# EAGLE design APA106_uno_shield (EAGLE 7.4.0)
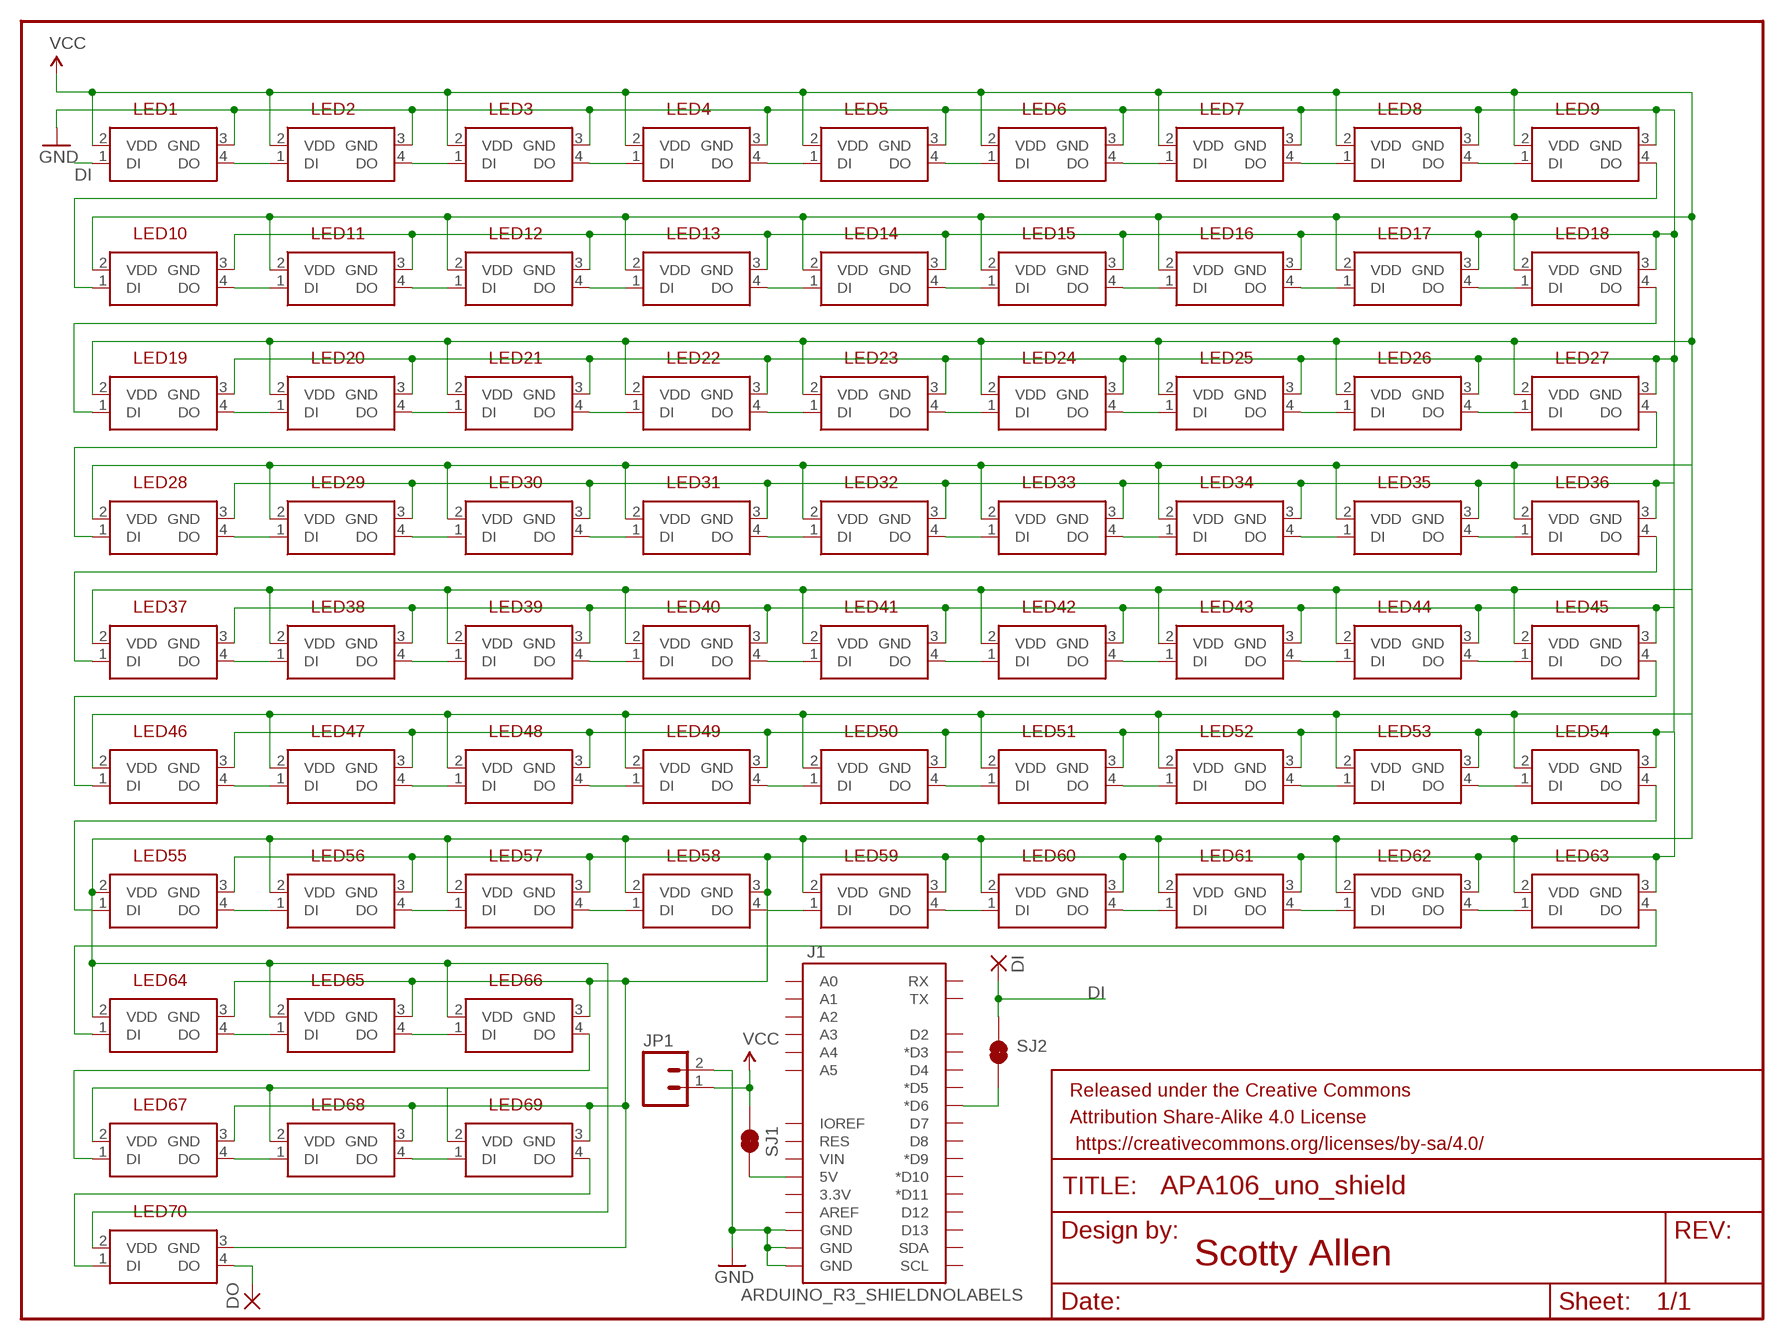
[diagram p0: schematic, sheet 1]

## Parts
DI  1,6/0,9  [1,6/0,9]
DO  1,6/0,9  [1,6/0,9]
FRAME1  FRAME-LETTER  [CREATIVE_COMMONS]
J1  ARDUINO_R3_SHIELDNOLABELS  [UNO_R3_SHIELD_NOLABELS]
JP1  M02PTH  [1X02]
LED1  LED-APA106HOLE-OFFSET-SPREAD  [LED-5MM-4PIN-HOLE-OFFSET-SPREAD]
LED2  LED-APA106HOLE-OFFSET-SPREAD  [LED-5MM-4PIN-HOLE-OFFSET-SPREAD]
LED3  LED-APA106HOLE-OFFSET-SPREAD  [LED-5MM-4PIN-HOLE-OFFSET-SPREAD]
LED4  LED-APA106HOLE-OFFSET-SPREAD  [LED-5MM-4PIN-HOLE-OFFSET-SPREAD]
LED5  LED-APA106HOLE-OFFSET-SPREAD  [LED-5MM-4PIN-HOLE-OFFSET-SPREAD]
LED6  LED-APA106HOLE-OFFSET-SPREAD  [LED-5MM-4PIN-HOLE-OFFSET-SPREAD]
LED7  LED-APA106HOLE-OFFSET-SPREAD  [LED-5MM-4PIN-HOLE-OFFSET-SPREAD]
LED8  LED-APA106HOLE-OFFSET-SPREAD  [LED-5MM-4PIN-HOLE-OFFSET-SPREAD]
LED9  LED-APA106HOLE-OFFSET-SPREAD  [LED-5MM-4PIN-HOLE-OFFSET-SPREAD]
LED10  LED-APA106HOLE-OFFSET-SPREAD  [LED-5MM-4PIN-HOLE-OFFSET-SPREAD]
LED11  LED-APA106HOLE-OFFSET-SPREAD  [LED-5MM-4PIN-HOLE-OFFSET-SPREAD]
LED12  LED-APA106HOLE-OFFSET-SPREAD  [LED-5MM-4PIN-HOLE-OFFSET-SPREAD]
LED13  LED-APA106HOLE-OFFSET-SPREAD  [LED-5MM-4PIN-HOLE-OFFSET-SPREAD]
LED14  LED-APA106HOLE-OFFSET-SPREAD  [LED-5MM-4PIN-HOLE-OFFSET-SPREAD]
LED15  LED-APA106HOLE-OFFSET-SPREAD  [LED-5MM-4PIN-HOLE-OFFSET-SPREAD]
LED16  LED-APA106HOLE-OFFSET-SPREAD  [LED-5MM-4PIN-HOLE-OFFSET-SPREAD]
LED17  LED-APA106HOLE-OFFSET-SPREAD  [LED-5MM-4PIN-HOLE-OFFSET-SPREAD]
LED18  LED-APA106HOLE-OFFSET-SPREAD  [LED-5MM-4PIN-HOLE-OFFSET-SPREAD]
LED19  LED-APA106HOLE-OFFSET-SPREAD  [LED-5MM-4PIN-HOLE-OFFSET-SPREAD]
LED20  LED-APA106HOLE-OFFSET-SPREAD  [LED-5MM-4PIN-HOLE-OFFSET-SPREAD]
LED21  LED-APA106HOLE-OFFSET-SPREAD  [LED-5MM-4PIN-HOLE-OFFSET-SPREAD]
LED22  LED-APA106HOLE-OFFSET-SPREAD  [LED-5MM-4PIN-HOLE-OFFSET-SPREAD]
LED23  LED-APA106HOLE-OFFSET-SPREAD  [LED-5MM-4PIN-HOLE-OFFSET-SPREAD]
LED24  LED-APA106HOLE-OFFSET-SPREAD  [LED-5MM-4PIN-HOLE-OFFSET-SPREAD]
LED25  LED-APA106HOLE-OFFSET-SPREAD  [LED-5MM-4PIN-HOLE-OFFSET-SPREAD]
LED26  LED-APA106HOLE-OFFSET-SPREAD  [LED-5MM-4PIN-HOLE-OFFSET-SPREAD]
LED27  LED-APA106HOLE-OFFSET-SPREAD  [LED-5MM-4PIN-HOLE-OFFSET-SPREAD]
LED28  LED-APA106HOLE-OFFSET-SPREAD  [LED-5MM-4PIN-HOLE-OFFSET-SPREAD]
LED29  LED-APA106HOLE-OFFSET-SPREAD  [LED-5MM-4PIN-HOLE-OFFSET-SPREAD]
LED30  LED-APA106HOLE-OFFSET-SPREAD  [LED-5MM-4PIN-HOLE-OFFSET-SPREAD]
LED31  LED-APA106HOLE-OFFSET-SPREAD  [LED-5MM-4PIN-HOLE-OFFSET-SPREAD]
LED32  LED-APA106HOLE-OFFSET-SPREAD  [LED-5MM-4PIN-HOLE-OFFSET-SPREAD]
LED33  LED-APA106HOLE-OFFSET-SPREAD  [LED-5MM-4PIN-HOLE-OFFSET-SPREAD]
LED34  LED-APA106HOLE-OFFSET-SPREAD  [LED-5MM-4PIN-HOLE-OFFSET-SPREAD]
LED35  LED-APA106HOLE-OFFSET-SPREAD  [LED-5MM-4PIN-HOLE-OFFSET-SPREAD]
LED36  LED-APA106HOLE-OFFSET-SPREAD  [LED-5MM-4PIN-HOLE-OFFSET-SPREAD]
LED37  LED-APA106HOLE-OFFSET-SPREAD  [LED-5MM-4PIN-HOLE-OFFSET-SPREAD]
LED38  LED-APA106HOLE-OFFSET-SPREAD  [LED-5MM-4PIN-HOLE-OFFSET-SPREAD]
LED39  LED-APA106HOLE-OFFSET-SPREAD  [LED-5MM-4PIN-HOLE-OFFSET-SPREAD]
LED40  LED-APA106HOLE-OFFSET-SPREAD  [LED-5MM-4PIN-HOLE-OFFSET-SPREAD]
LED41  LED-APA106HOLE-OFFSET-SPREAD  [LED-5MM-4PIN-HOLE-OFFSET-SPREAD]
LED42  LED-APA106HOLE-OFFSET-SPREAD  [LED-5MM-4PIN-HOLE-OFFSET-SPREAD]
LED43  LED-APA106HOLE-OFFSET-SPREAD  [LED-5MM-4PIN-HOLE-OFFSET-SPREAD]
LED44  LED-APA106HOLE-OFFSET-SPREAD  [LED-5MM-4PIN-HOLE-OFFSET-SPREAD]
LED45  LED-APA106HOLE-OFFSET-SPREAD  [LED-5MM-4PIN-HOLE-OFFSET-SPREAD]
LED46  LED-APA106HOLE-OFFSET-SPREAD  [LED-5MM-4PIN-HOLE-OFFSET-SPREAD]
LED47  LED-APA106HOLE-OFFSET-SPREAD  [LED-5MM-4PIN-HOLE-OFFSET-SPREAD]
LED48  LED-APA106HOLE-OFFSET-SPREAD  [LED-5MM-4PIN-HOLE-OFFSET-SPREAD]
LED49  LED-APA106HOLE-OFFSET-SPREAD  [LED-5MM-4PIN-HOLE-OFFSET-SPREAD]
LED50  LED-APA106HOLE-OFFSET-SPREAD  [LED-5MM-4PIN-HOLE-OFFSET-SPREAD]
LED51  LED-APA106HOLE-OFFSET-SPREAD  [LED-5MM-4PIN-HOLE-OFFSET-SPREAD]
LED52  LED-APA106HOLE-OFFSET-SPREAD  [LED-5MM-4PIN-HOLE-OFFSET-SPREAD]
LED53  LED-APA106HOLE-OFFSET-SPREAD  [LED-5MM-4PIN-HOLE-OFFSET-SPREAD]
LED54  LED-APA106HOLE-OFFSET-SPREAD  [LED-5MM-4PIN-HOLE-OFFSET-SPREAD]
LED55  LED-APA106HOLE-OFFSET-SPREAD  [LED-5MM-4PIN-HOLE-OFFSET-SPREAD]
LED56  LED-APA106HOLE-OFFSET-SPREAD  [LED-5MM-4PIN-HOLE-OFFSET-SPREAD]
LED57  LED-APA106HOLE-OFFSET-SPREAD  [LED-5MM-4PIN-HOLE-OFFSET-SPREAD]
LED58  LED-APA106HOLE-OFFSET-SPREAD  [LED-5MM-4PIN-HOLE-OFFSET-SPREAD]
LED59  LED-APA106HOLE-OFFSET-SPREAD  [LED-5MM-4PIN-HOLE-OFFSET-SPREAD]
LED60  LED-APA106HOLE-OFFSET-SPREAD  [LED-5MM-4PIN-HOLE-OFFSET-SPREAD]
LED61  LED-APA106HOLE-OFFSET-SPREAD  [LED-5MM-4PIN-HOLE-OFFSET-SPREAD]
LED62  LED-APA106HOLE-OFFSET-SPREAD  [LED-5MM-4PIN-HOLE-OFFSET-SPREAD]
LED63  LED-APA106HOLE-OFFSET-SPREAD  [LED-5MM-4PIN-HOLE-OFFSET-SPREAD]
LED64  LED-APA106HOLE-OFFSET-SPREAD  [LED-5MM-4PIN-HOLE-OFFSET-SPREAD]
LED65  LED-APA106HOLE-OFFSET-SPREAD  [LED-5MM-4PIN-HOLE-OFFSET-SPREAD]
LED66  LED-APA106HOLE-OFFSET-SPREAD  [LED-5MM-4PIN-HOLE-OFFSET-SPREAD]
LED67  LED-APA106HOLE-OFFSET-SPREAD  [LED-5MM-4PIN-HOLE-OFFSET-SPREAD]
LED68  LED-APA106HOLE-OFFSET-SPREAD  [LED-5MM-4PIN-HOLE-OFFSET-SPREAD]
LED69  LED-APA106HOLE-OFFSET-SPREAD  [LED-5MM-4PIN-HOLE-OFFSET-SPREAD]
LED70  LED-APA106HOLE-OFFSET-SPREAD  [LED-5MM-4PIN-HOLE-OFFSET-SPREAD]
SJ1  JUMPER-PAD-2-NC_BY_TRACENO_SILK  [PAD-JUMPER-2-NC_BY_TRACE_NO_SILK]
SJ2  JUMPER-PAD-2-NC_BY_TRACENO_SILK  [PAD-JUMPER-2-NC_BY_TRACE_NO_SILK]

## Nets
DI: DI.1(P) LED1.1(DI) SJ2.2
GND [power]: J1.GND@0(GND) J1.GND@1(GND) J1.GND@2(GND) JP1.2 LED1.3(GND) LED2.3(GND) LED3.3(GND) LED4.3(GND) LED5.3(GND) LED6.3(GND) LED7.3(GND) LED8.3(GND) LED9.3(GND) LED10.3(GND) LED11.3(GND) LED12.3(GND) LED13.3(GND) LED14.3(GND) LED15.3(GND) LED16.3(GND) LED17.3(GND) LED18.3(GND) LED19.3(GND) LED20.3(GND) LED21.3(GND) LED22.3(GND) LED23.3(GND) LED24.3(GND) LED25.3(GND) LED26.3(GND) LED27.3(GND) LED28.3(GND) LED29.3(GND) LED30.3(GND) LED31.3(GND) LED32.3(GND) LED33.3(GND) LED34.3(GND) LED35.3(GND) LED36.3(GND) LED37.3(GND) LED38.3(GND) LED39.3(GND) LED40.3(GND) LED41.3(GND) LED42.3(GND) LED43.3(GND) LED44.3(GND) LED45.3(GND) LED46.3(GND) LED47.3(GND) LED48.3(GND) LED49.3(GND) LED50.3(GND) LED51.3(GND) LED52.3(GND) LED53.3(GND) LED54.3(GND) LED55.3(GND) LED56.3(GND) LED57.3(GND) LED58.3(GND) LED59.3(GND) LED60.3(GND) LED61.3(GND) LED62.3(GND) LED63.3(GND) LED64.3(GND) LED65.3(GND) LED66.3(GND) LED67.3(GND) LED68.3(GND) LED69.3(GND) LED70.3(GND)
N$1: LED1.4(DO) LED2.1(DI)
N$2: LED2.4(DO) LED3.1(DI)
N$3: LED3.4(DO) LED4.1(DI)
N$4: LED4.4(DO) LED5.1(DI)
N$5: LED6.4(DO) LED7.1(DI)
N$6: LED7.4(DO) LED8.1(DI)
N$7: LED37.4(DO) LED38.1(DI)
N$8: LED5.4(DO) LED6.1(DI)
N$9: LED8.4(DO) LED9.1(DI)
N$10: LED10.4(DO) LED11.1(DI)
N$11: LED19.4(DO) LED20.1(DI)
N$12: LED20.4(DO) LED21.1(DI)
N$13: LED11.4(DO) LED12.1(DI)
N$14: LED12.4(DO) LED13.1(DI)
N$15: LED21.4(DO) LED22.1(DI)
N$16: LED22.4(DO) LED23.1(DI)
N$17: LED18.4(DO) LED19.1(DI)
N$18: LED23.4(DO) LED24.1(DI)
N$19: LED13.4(DO) LED14.1(DI)
N$20: LED9.4(DO) LED10.1(DI)
N$21: LED14.4(DO) LED15.1(DI)
N$22: LED15.4(DO) LED16.1(DI)
N$23: LED16.4(DO) LED17.1(DI)
N$24: LED17.4(DO) LED18.1(DI)
N$25: LED24.4(DO) LED25.1(DI)
N$26: LED25.4(DO) LED26.1(DI)
N$27: LED26.4(DO) LED27.1(DI)
N$28: LED28.4(DO) LED29.1(DI)
N$29: LED29.4(DO) LED30.1(DI)
N$30: LED30.4(DO) LED31.1(DI)
N$31: LED31.4(DO) LED32.1(DI)
N$32: LED27.4(DO) LED28.1(DI)
N$33: LED32.4(DO) LED33.1(DI)
N$34: LED33.4(DO) LED34.1(DI)
N$35: LED34.4(DO) LED35.1(DI)
N$36: LED35.4(DO) LED36.1(DI)
N$37: LED38.4(DO) LED39.1(DI)
N$38: LED39.4(DO) LED40.1(DI)
N$39: LED40.4(DO) LED41.1(DI)
N$40: LED36.4(DO) LED37.1(DI)
N$41: LED41.4(DO) LED42.1(DI)
N$42: LED42.4(DO) LED43.1(DI)
N$43: LED43.4(DO) LED44.1(DI)
N$44: LED44.4(DO) LED45.1(DI)
N$45: LED46.4(DO) LED47.1(DI)
N$46: LED47.4(DO) LED48.1(DI)
N$47: LED48.4(DO) LED49.1(DI)
N$48: LED49.4(DO) LED50.1(DI)
N$49: LED45.4(DO) LED46.1(DI)
N$50: LED50.4(DO) LED51.1(DI)
N$51: LED51.4(DO) LED52.1(DI)
N$52: LED52.4(DO) LED53.1(DI)
N$53: LED53.4(DO) LED54.1(DI)
N$54: LED55.4(DO) LED56.1(DI)
N$55: LED56.4(DO) LED57.1(DI)
N$56: LED57.4(DO) LED58.1(DI)
N$57: LED58.4(DO) LED59.1(DI)
N$58: LED54.4(DO) LED55.1(DI)
N$59: LED59.4(DO) LED60.1(DI)
N$60: LED60.4(DO) LED61.1(DI)
N$61: LED61.4(DO) LED62.1(DI)
N$62: LED62.4(DO) LED63.1(DI)
N$63: LED64.4(DO) LED65.1(DI)
N$64: LED65.4(DO) LED66.1(DI)
N$65: LED67.4(DO) LED68.1(DI)
N$66: LED63.4(DO) LED64.1(DI)
N$67: LED68.4(DO) LED69.1(DI)
N$68: LED66.4(DO) LED67.1(DI)
N$69: LED69.4(DO) LED70.1(DI)
N$70 [lowpower]: J1.5V SJ1.1
N$71: DO.1(P) LED70.4(DO)
N$72: J1.D6(*D6) SJ2.1
VCC [power]: JP1.1 LED1.2(VDD) LED2.2(VDD) LED3.2(VDD) LED4.2(VDD) LED5.2(VDD) LED6.2(VDD) LED7.2(VDD) LED8.2(VDD) LED9.2(VDD) LED10.2(VDD) LED11.2(VDD) LED12.2(VDD) LED13.2(VDD) LED14.2(VDD) LED15.2(VDD) LED16.2(VDD) LED17.2(VDD) LED18.2(VDD) LED19.2(VDD) LED20.2(VDD) LED21.2(VDD) LED22.2(VDD) LED23.2(VDD) LED24.2(VDD) LED25.2(VDD) LED26.2(VDD) LED27.2(VDD) LED28.2(VDD) LED29.2(VDD) LED30.2(VDD) LED31.2(VDD) LED32.2(VDD) LED33.2(VDD) LED34.2(VDD) LED35.2(VDD) LED36.2(VDD) LED37.2(VDD) LED38.2(VDD) LED39.2(VDD) LED40.2(VDD) LED41.2(VDD) LED42.2(VDD) LED43.2(VDD) LED44.2(VDD) LED45.2(VDD) LED46.2(VDD) LED47.2(VDD) LED48.2(VDD) LED49.2(VDD) LED50.2(VDD) LED51.2(VDD) LED52.2(VDD) LED53.2(VDD) LED54.2(VDD) LED55.2(VDD) LED56.2(VDD) LED57.2(VDD) LED58.2(VDD) LED59.2(VDD) LED60.2(VDD) LED61.2(VDD) LED62.2(VDD) LED63.2(VDD) LED64.2(VDD) LED65.2(VDD) LED66.2(VDD) LED67.2(VDD) LED68.2(VDD) LED69.2(VDD) LED70.2(VDD) SJ1.2
Unconnected: J1.3.3V J1.A0 J1.A1 J1.A2 J1.A3 J1.A4 J1.A5 J1.AREF J1.D2 J1.D3(*D3) J1.D4 J1.D5(*D5) J1.D7 J1.D8 J1.D9(*D9) J1.D10(*D10) J1.D11(*D11) J1.D12 J1.D13 J1.IOREF J1.RES J1.RX J1.SCL J1.SDA J1.TX J1.VIN

## Library data of the parts
DI DO = wirepad:1,6/0,9: THROUGH-HOLE PAD
FRAME1 = SparkFun-Aesthetics:FRAME-LETTER: Schematic Frame Standard 8.5x11 US Letter frame
J1 = scotty:ARDUINO_R3_SHIELD: Shield form compatible with the Arduino Uno R3.
JP1 = SparkFun-Connectors:M02: Standard 2-pin 0.1" header. Use with - straight break away headers ( PRT-00116) - right angle break away headers (PRT-00553) - swiss pins (PRT-00743) - machine pins (PRT-00117) - female headers (PRT-00115) Molex polarized connector foot print use with: PRT-08233 with associated crimp pins and housings. 2.54_SCREWTERM for use with PRT-10571. 3.5mm Screw Terminal footprints for PRT-08084 5mm Screw Terminal footprints for use with PRT-08432
LED1-LED70 = scotty:LED-APA106
SJ1 SJ2 = scotty:JUMPER-PAD-2-NC_BY_TRACE

## Net classes
0 default: width 0.254 mm
1 power: width 1.27 mm
2 lowpower: width 0.406 mm

## Board
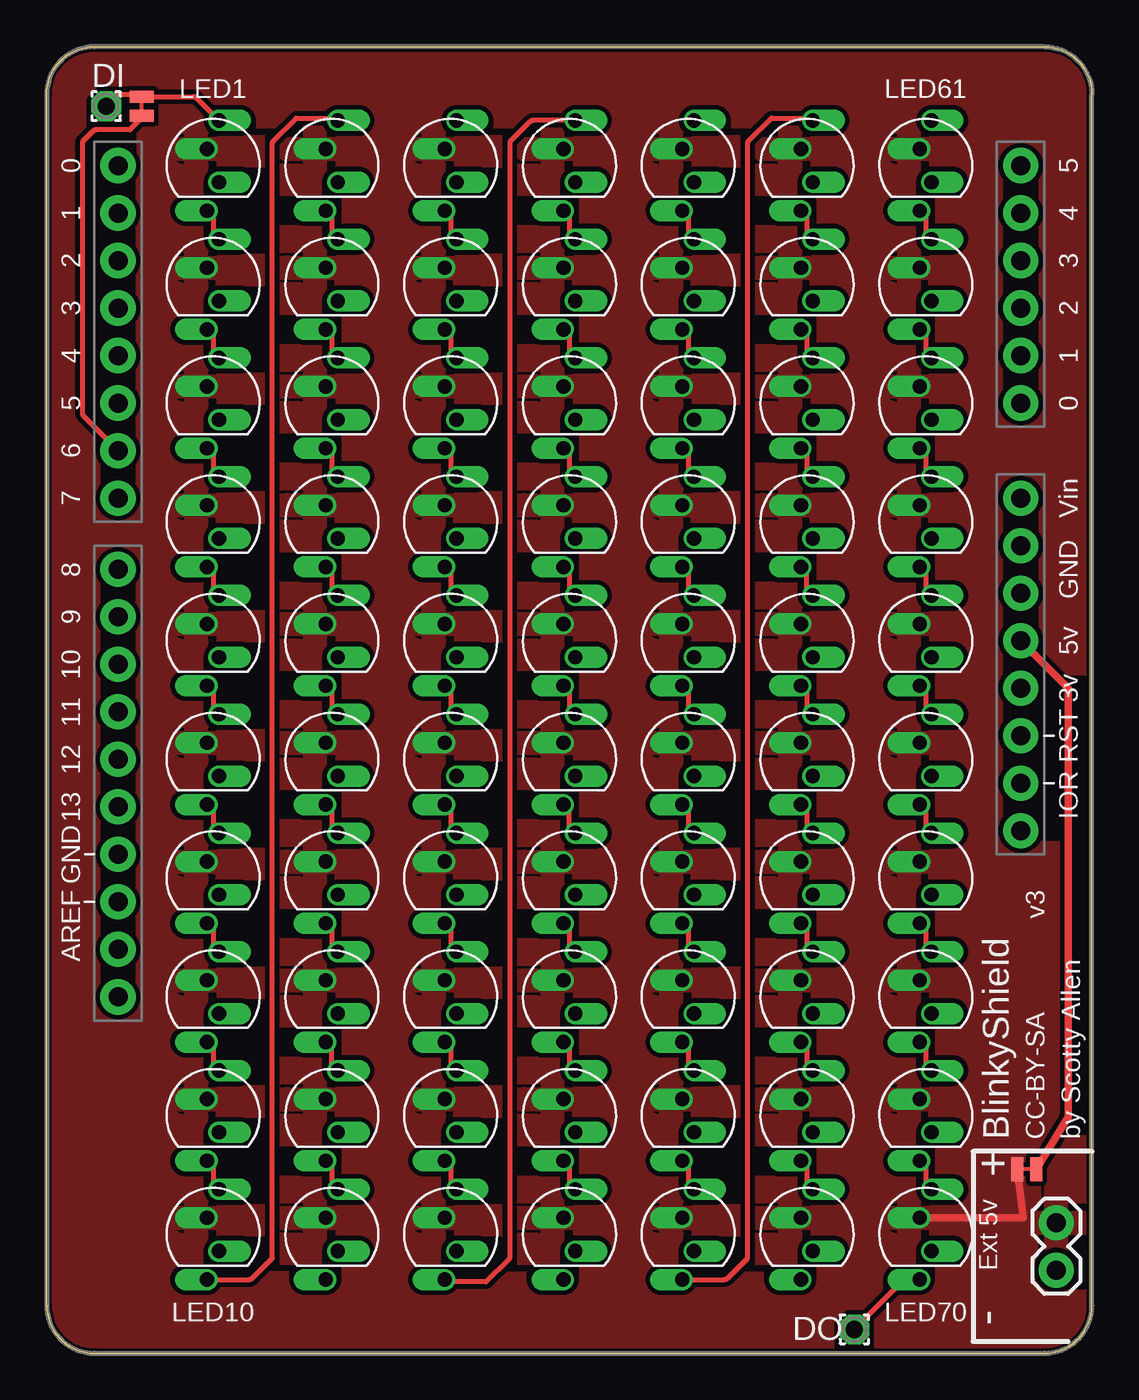
[diagram p1: board, top side]
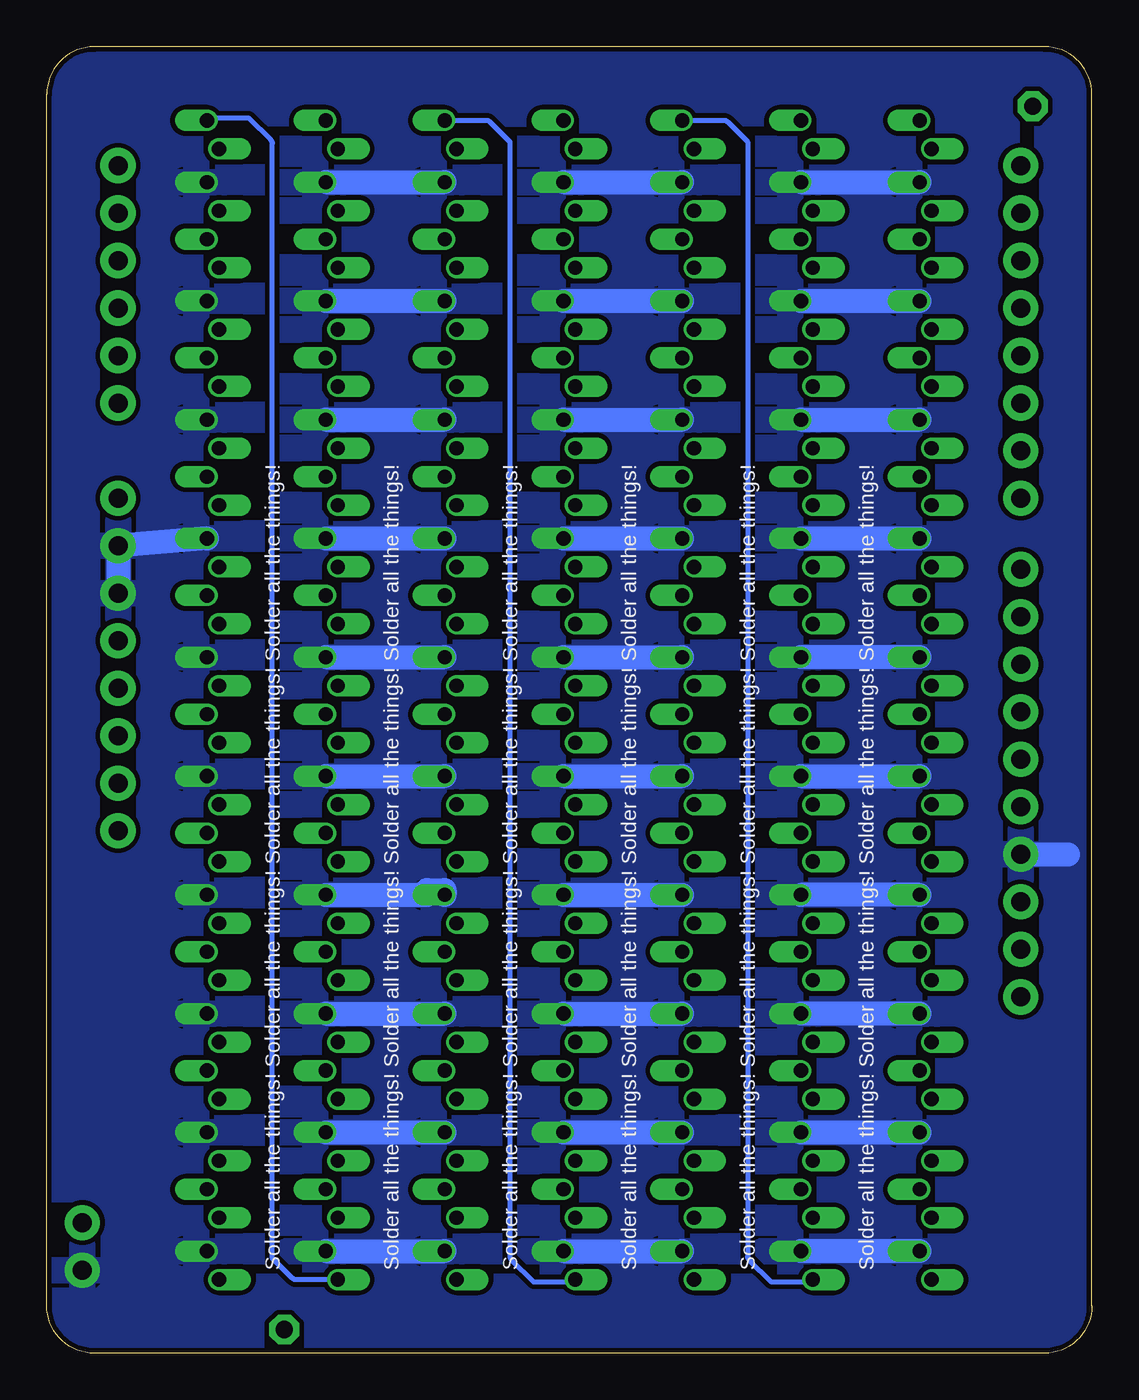
[diagram p2: board, bottom side, seen from below]

Size 55.88 x 69.85 mm. Coordinates in mm from the lower left corner, seen from the top.
Outline: 53.34,0 arc90 55.88,2.54 55.88,67.31 arc90 53.34,69.85 2.54,69.85 arc90 0,67.31 0,2.54 arc90 2.54,0 53.34,0
Copper layers (1*16): Top 0.035mm / dielectric 1.5mm / Bottom 0.035mm
Design rules "dirt_cheap_dirty_boards.v1 *": minimum track width 6mil, minimum drill 12mil, track to track 10mil, track to pad 10mil, pad to pad 10mil, via to via 10mil, smd to smd 0mil, copper to edge 10mil, drill to drill 10mil, minimum pad ring 6mil, minimum via ring 6mil, stop-mask expansion 2mil, vias tented up to drill 25mil, thermal gap 10mil

### Footprints (pad centres in the part's own frame; a part is rotated, then mirrored left to right if it is on the bottom)
1,6/0,9 = drill 0.914 pad 1.6 octagon: 1 0,0
UNO_R3_SHIELD_NOLABELS = drill 1.016 pad 1.88: 3.3V 52.07,35.56; 5V 52.07,38.1; A0 52.07,50.8; A1 52.07,53.34; A2 52.07,55.88; A3 52.07,58.42; A4 52.07,60.96; A5 52.07,63.5; AREF 3.81,24.13; D2 3.81,58.42; D3 3.81,55.88; D4 3.81,53.34; D5 3.81,50.8; D6 3.81,48.26; D7 3.81,45.72; D8 3.81,41.91; D9 3.81,39.37; D10 3.81,36.83; D11 3.81,34.29; D12 3.81,31.75; D13 3.81,29.21; GND@0 52.07,40.64; GND@1 52.07,43.18; GND@2 3.81,26.67; IOREF 52.07,30.48; NC 52.07,27.94; RES 52.07,33.02; RX 3.81,63.5; SCL 3.81,19.05; SDA 3.81,21.59; TX 3.81,60.96; VIN 52.07,45.72
1X02 = drill 1.016 pad 1.88: 1 0,0; 2 2.54,0
LED-5MM-4PIN-HOLE-OFFSET-SPREAD = drill 0.762 pad 1.016 offset: 1 -2.413,0.318; 2 -0.889,-0.318; 3 0.889,0.318; 4 2.413,-0.318
PAD-JUMPER-2-NC_BY_TRACE_NO_SILK = smd 0.635 x 1.27: 1 -0.508,0; 2 0.508,0

### Placement (x,y rotation side)
DI  3.17,66.67 0 top
DO  43.18,1.27 0 top
FRAME1  -5.71,-25.4 0 top  (outside the outline)
J1  0,0 0 top
JP1  53.98,6.99 270 top
LED1  8.89,63.5 270 top
LED2  8.89,57.15 270 top
LED3  8.89,50.8 270 top
LED4  8.89,44.45 270 top
LED5  8.89,38.1 270 top
LED6  8.89,31.75 270 top
LED7  8.89,25.4 270 top
LED8  8.89,19.05 270 top
LED9  8.89,12.7 270 top
LED10  8.89,6.35 270 top
LED11  15.24,63.5 270 top
LED12  15.24,57.15 270 top
LED13  15.24,50.8 270 top
LED14  15.24,44.45 270 top
LED15  15.24,38.1 270 top
LED16  15.24,31.75 270 top
LED17  15.24,25.4 270 top
LED18  15.24,19.05 270 top
LED19  15.24,12.7 270 top
LED20  15.24,6.35 270 top
LED21  21.59,63.5 270 top
LED22  21.59,57.15 270 top
LED23  21.59,50.8 270 top
LED24  21.59,44.45 270 top
LED25  21.59,38.1 270 top
LED26  21.59,31.75 270 top
LED27  21.59,25.4 270 top
LED28  21.59,19.05 270 top
LED29  21.59,12.7 270 top
LED30  21.59,6.35 270 top
LED31  27.94,63.5 270 top
LED32  27.94,57.15 270 top
LED33  27.94,50.8 270 top
LED34  27.94,44.45 270 top
LED35  27.94,38.1 270 top
LED36  27.94,31.75 270 top
LED37  27.94,25.4 270 top
LED38  27.94,19.05 270 top
LED39  27.94,12.7 270 top
LED40  27.94,6.35 270 top
LED41  34.29,63.5 270 top
LED42  34.29,57.15 270 top
LED43  34.29,50.8 270 top
LED44  34.29,44.45 270 top
LED45  34.29,38.1 270 top
LED46  34.29,31.75 270 top
LED47  34.29,25.4 270 top
LED48  34.29,19.05 270 top
LED49  34.29,12.7 270 top
LED50  34.29,6.35 270 top
LED51  40.64,63.5 270 top
LED52  40.64,57.15 270 top
LED53  40.64,50.8 270 top
LED54  40.64,44.45 270 top
LED55  40.64,38.1 270 top
LED56  40.64,31.75 270 top
LED57  40.64,25.4 270 top
LED58  40.64,19.05 270 top
LED59  40.64,12.7 270 top
LED60  40.64,6.35 270 top
LED61  46.99,63.5 270 top
LED62  46.99,57.15 270 top
LED63  46.99,50.8 270 top
LED64  46.99,44.45 270 top
LED65  46.99,38.1 270 top
LED66  46.99,31.75 270 top
LED67  46.99,25.4 270 top
LED68  46.99,19.05 270 top
LED69  46.99,12.7 270 top
LED70  46.99,6.35 270 top
SJ1  52.39,9.84 180 top
SJ2  5.08,66.67 90 top

### Tracks (layer width: path | path; a pad name or v marks a point on that pad's centre or on a via)
DI
  Top 0.254: DI.1 3.81,67.31 4.85,67.31 arc-45 5.03,67.24 SJ2.2 7.83,67.18 arc-45 8.01,67.11 LED1.1
GND
  Bottom 1.27: J1.GND@2 1.27,26.67 | J1.GND@0 J1.GND@1 LED64.3 | LED60.3 LED50.3 | LED40.3 LED30.3 | LED39.3 LED29.3 | LED59.3 LED49.3 | LED58.3 LED48.3 | LED57.3 35.56,24.51 35.56,24.77 34.61,24.77 LED47.3 | LED56.3 LED46.3 | LED55.3 LED45.3 | LED54.3 LED44.3 | LED53.3 LED43.3 | LED52.3 LED42.3 | LED51.3 LED41.3 | LED11.3 LED1.3 | LED12.3 LED2.3 | LED13.3 LED3.3 | LED14.3 LED4.3 | LED5.3 LED15.3 | LED16.3 LED6.3 | LED7.3 LED17.3 | LED8.3 LED18.3 | LED38.3 LED28.3 | LED37.3 LED27.3 | LED36.3 LED26.3 | LED19.3 LED9.3 | LED10.3 LED20.3 | LED35.3 LED25.3 | LED34.3 LED24.3 | LED33.3 LED23.3 | LED32.3 LED22.3 | LED31.3 LED21.3
  pour Bottom: 2.54,0 53.34,0 arc90 55.88,2.54 55.88,67.31 arc90 53.34,69.85 2.54,69.85 arc90 0,67.31 0,2.54 arc90
N$1
  Top 0.254: LED2.1 8.89,59.69 8.89,60.96 LED1.4
N$2
  Top 0.254: LED3.1 8.89,53.34 8.89,54.61 LED2.4
N$3
  Top 0.254: LED4.1 8.89,46.99 8.89,48.26 LED3.4
N$4
  Top 0.254: LED5.1 8.89,40.64 8.89,41.91 LED4.4
N$5
  Top 0.254: LED7.1 8.89,27.94 8.89,29.21 LED6.4
N$6
  Top 0.254: LED8.1 8.89,21.59 8.89,22.86 LED7.4
N$7
  Top 0.254: LED38.1 27.94,21.59 27.94,22.86 LED37.4
N$8
  Top 0.254: LED6.1 8.89,34.29 8.89,35.56 LED5.4
N$9
  Top 0.254: LED9.1 8.89,15.24 8.89,16.51 LED8.4
N$10
  Top 0.254: LED10.4 10.82,3.94 arc45 11,4.01 12.06,5.08 12.06,64.67 arc-45 12.14,64.84 13.34,66.04 15.32,66.04 arc-45 15.51,65.97 LED11.1
N$11
  Top 0.254: LED20.1 15.24,8.89 15.24,10.16 LED19.4
N$12
  Bottom 0.254: LED21.1 19.66,65.91 arc45 19.48,65.84 18.41,64.77 18.41,5.18 arc-45 18.34,5.01 17.14,3.81 15.15,3.81 arc-45 14.97,3.88 LED20.4
N$13
  Top 0.254: LED12.1 15.24,59.69 15.24,60.96 LED11.4
N$14
  Top 0.254: LED13.1 15.24,53.34 15.24,54.61 LED12.4
N$15
  Top 0.254: LED22.1 21.59,59.69 21.59,60.96 LED21.4
N$16
  Top 0.254: LED23.1 21.59,53.34 21.59,54.61 LED22.4
N$17
  Top 0.254: LED18.4 15.24,16.51 15.24,15.24 LED19.1
N$18
  Top 0.254: LED24.1 21.59,46.99 21.59,48.26 LED23.4
N$19
  Top 0.254: LED14.1 15.24,46.99 15.24,48.26 LED13.4
N$20
  Top 0.254: LED10.1 8.89,8.89 8.89,10.16 LED9.4
N$21
  Top 0.254: LED15.1 15.24,40.64 15.24,41.91 LED14.4
N$22
  Top 0.254: LED16.1 15.24,34.29 15.24,35.56 LED15.4
N$23
  Top 0.254: LED17.1 15.24,27.94 15.24,29.21 LED16.4
N$24
  Top 0.254: LED18.1 15.24,21.59 15.24,22.86 LED17.4
N$25
  Top 0.254: LED25.1 21.59,40.64 21.59,41.91 LED24.4
N$26
  Top 0.254: LED26.1 21.59,34.29 21.59,35.56 LED25.4
N$27
  Top 0.254: LED27.1 21.59,27.94 21.59,29.21 LED26.4
N$28
  Top 0.254: LED29.1 21.59,15.24 21.59,16.51 LED28.4
N$29
  Top 0.254: LED30.1 21.59,8.89 21.59,10.16 LED29.4
N$30
  Top 0.254: LED31.1 26.01,65.91 arc45 25.83,65.84 24.77,64.77 24.77,5.18 arc-45 24.69,5.01 23.5,3.81 21.5,3.81 arc-45 21.32,3.88 LED30.4
N$31
  Top 0.254: LED32.1 27.94,59.69 27.94,60.96 LED31.4
N$32
  Top 0.254: LED28.1 21.59,21.59 21.59,22.86 LED27.4
N$33
  Top 0.254: LED33.1 27.94,53.34 27.94,54.61 LED32.4
N$34
  Top 0.254: LED34.1 27.94,46.99 27.94,48.26 LED33.4
N$35
  Top 0.254: LED35.1 27.94,40.64 27.94,41.91 LED34.4
N$36
  Top 0.254: LED36.1 27.94,34.29 27.94,35.56 LED35.4
N$37
  Top 0.254: LED39.1 27.94,15.24 27.94,16.51 LED38.4
N$38
  Top 0.254: LED40.1 27.94,8.89 27.94,10.16 LED39.4
N$39
  Bottom 0.254: LED41.1 32.36,65.91 arc45 32.18,65.84 31.11,64.77 31.11,5.18 arc-45 31.04,5.01 29.84,3.81 27.86,3.81 arc-45 27.68,3.88 LED40.4
N$40
  Top 0.254: LED36.4 27.94,29.21 27.94,27.94 LED37.1
N$41
  Top 0.254: LED42.1 34.29,59.69 34.29,60.96 LED41.4
N$42
  Top 0.254: LED43.1 34.29,53.34 34.29,54.61 LED42.4
N$43
  Top 0.254: LED44.1 34.29,46.99 34.29,48.26 LED43.4
N$44
  Top 0.254: LED45.1 34.29,40.64 34.29,41.91 LED44.4
N$45
  Top 0.254: LED47.1 34.29,27.94 34.29,29.21 LED46.4
N$46
  Top 0.254: LED48.1 34.29,21.59 34.29,22.86 LED47.4
N$47
  Top 0.254: LED49.1 34.29,15.24 34.29,16.51 LED48.4
N$48
  Top 0.254: LED50.1 34.29,8.89 34.29,10.16 LED49.4
N$49
  Top 0.254: LED46.1 34.29,34.29 34.29,35.56 LED45.4
N$50
  Top 0.254: LED50.4 36.22,3.94 arc45 36.4,4.01 37.47,5.08 37.47,64.67 arc-45 37.54,64.84 38.73,66.04 40.73,66.04 arc-45 40.91,65.97 LED51.1
N$51
  Top 0.254: LED52.1 40.64,59.69 40.64,60.96 LED51.4
N$52
  Top 0.254: LED53.1 40.64,53.34 40.64,54.61 LED52.4
N$53
  Top 0.254: LED54.1 40.64,46.99 40.64,48.26 LED53.4
N$54
  Top 0.254: LED56.1 40.64,34.29 40.64,35.56 LED55.4
N$55
  Top 0.254: LED57.1 40.64,27.94 40.64,29.21 LED56.4
N$56
  Top 0.254: LED58.1 40.64,21.59 40.64,22.86 LED57.4
N$57
  Top 0.254: LED59.1 40.64,15.24 40.64,16.51 LED58.4
N$58
  Top 0.254: LED54.4 40.64,41.91 40.64,40.64 LED55.1
N$59
  Top 0.254: LED60.1 40.64,8.89 40.64,10.16 LED59.4
N$60
  Bottom 0.254: LED60.4 42.57,3.94 arc45 42.75,4.01 43.81,5.08 43.81,64.67 arc-45 43.89,64.84 45.09,66.04 47.08,66.04 arc-45 47.26,65.97 LED61.1
N$61
  Top 0.254: LED62.1 46.99,59.69 46.99,60.96 LED61.4
N$62
  Top 0.254: LED63.1 46.99,53.34 46.99,54.61 LED62.4
N$63
  Top 0.254: LED65.1 46.99,40.64 46.99,41.91 LED64.4
N$64
  Top 0.254: LED66.1 46.99,34.29 46.99,35.56 LED65.4
N$65
  Top 0.254: LED68.1 46.99,21.59 46.99,22.86 LED67.4
N$66
  Top 0.254: LED64.1 46.99,46.99 46.99,48.26 LED63.4
N$67
  Top 0.254: LED69.1 46.99,15.24 46.99,16.51 LED68.4
N$68
  Top 0.254: LED67.1 46.99,27.94 46.99,29.21 LED66.4
N$69
  Top 0.254: LED70.1 46.99,8.89 46.99,10.16 LED69.4
N$70
  Top 0.406: J1.5V 54.61,35.56 54.61,12.68 arc-45 54.54,12.5 SJ1.1
N$71
  Top 0.254: LED70.4 45.95,3.94 arc45 45.77,3.86 DO.1
N$72
  Top 0.254: SJ2.1 5.08,66.14 arc-45 5.01,65.97 4.45,65.41 2.65,65.41 arc45 2.47,65.33 1.91,64.77 1.91,50.27 arc45 1.98,50.09 J1.D6
VCC
  Top 0.406: LED70.2 52.2,7.24 SJ1.2
  pour Top: 0,2.54 arc90 2.54,0 53.34,0 arc90 55.88,2.54 55.88,67.31 arc90 53.34,69.85 2.54,69.85 arc90 0,67.31

### Text on the board
tPlace: v3 | BlinkyShield | CC-BY-SA | by Scotty Allen | Ext 5v
tNames: + | -
bNames: Solder all the things! Solder all the things! Solder all the things! Solder all the things! | Solder all the things! Solder all the things! Solder all the things! Solder all the things! | Solder all the things! Solder all the things! Solder all the things! Solder all the things! | Solder all the things! Solder all the things! Solder all the things! Solder all the things! | Solder all the things! Solder all the things! Solder all the things! Solder all the things! | Solder all the things! Solder all the things! Solder all the things! Solder all the things!